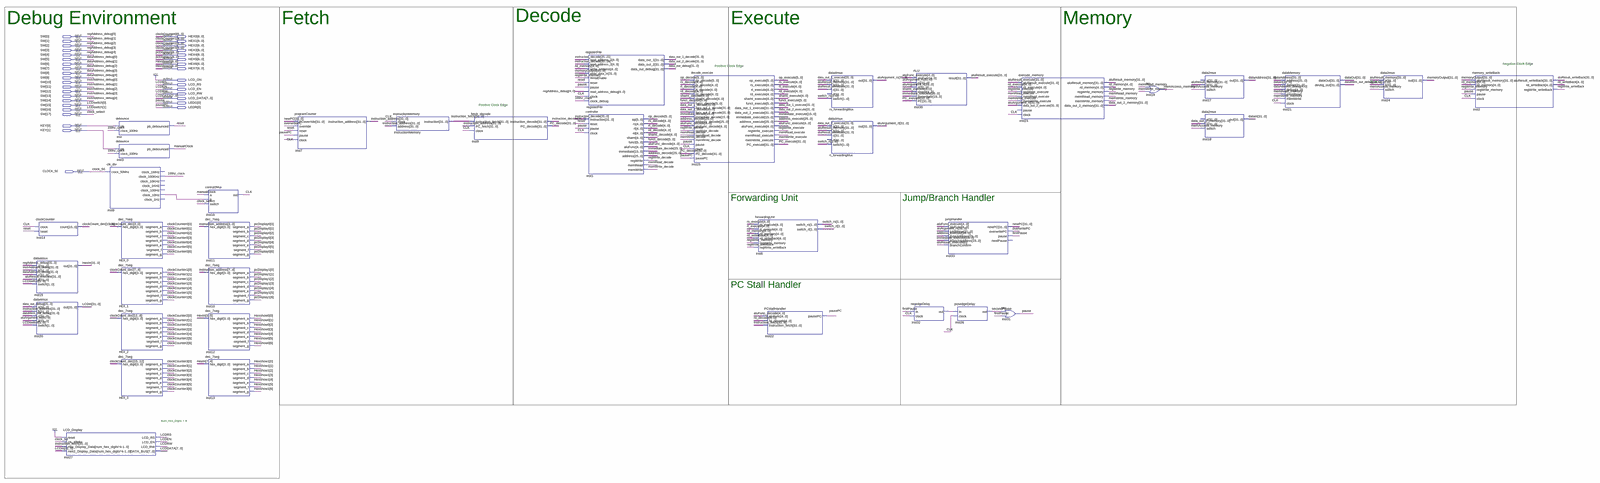
[diagram p0: schematic sheet, whole]
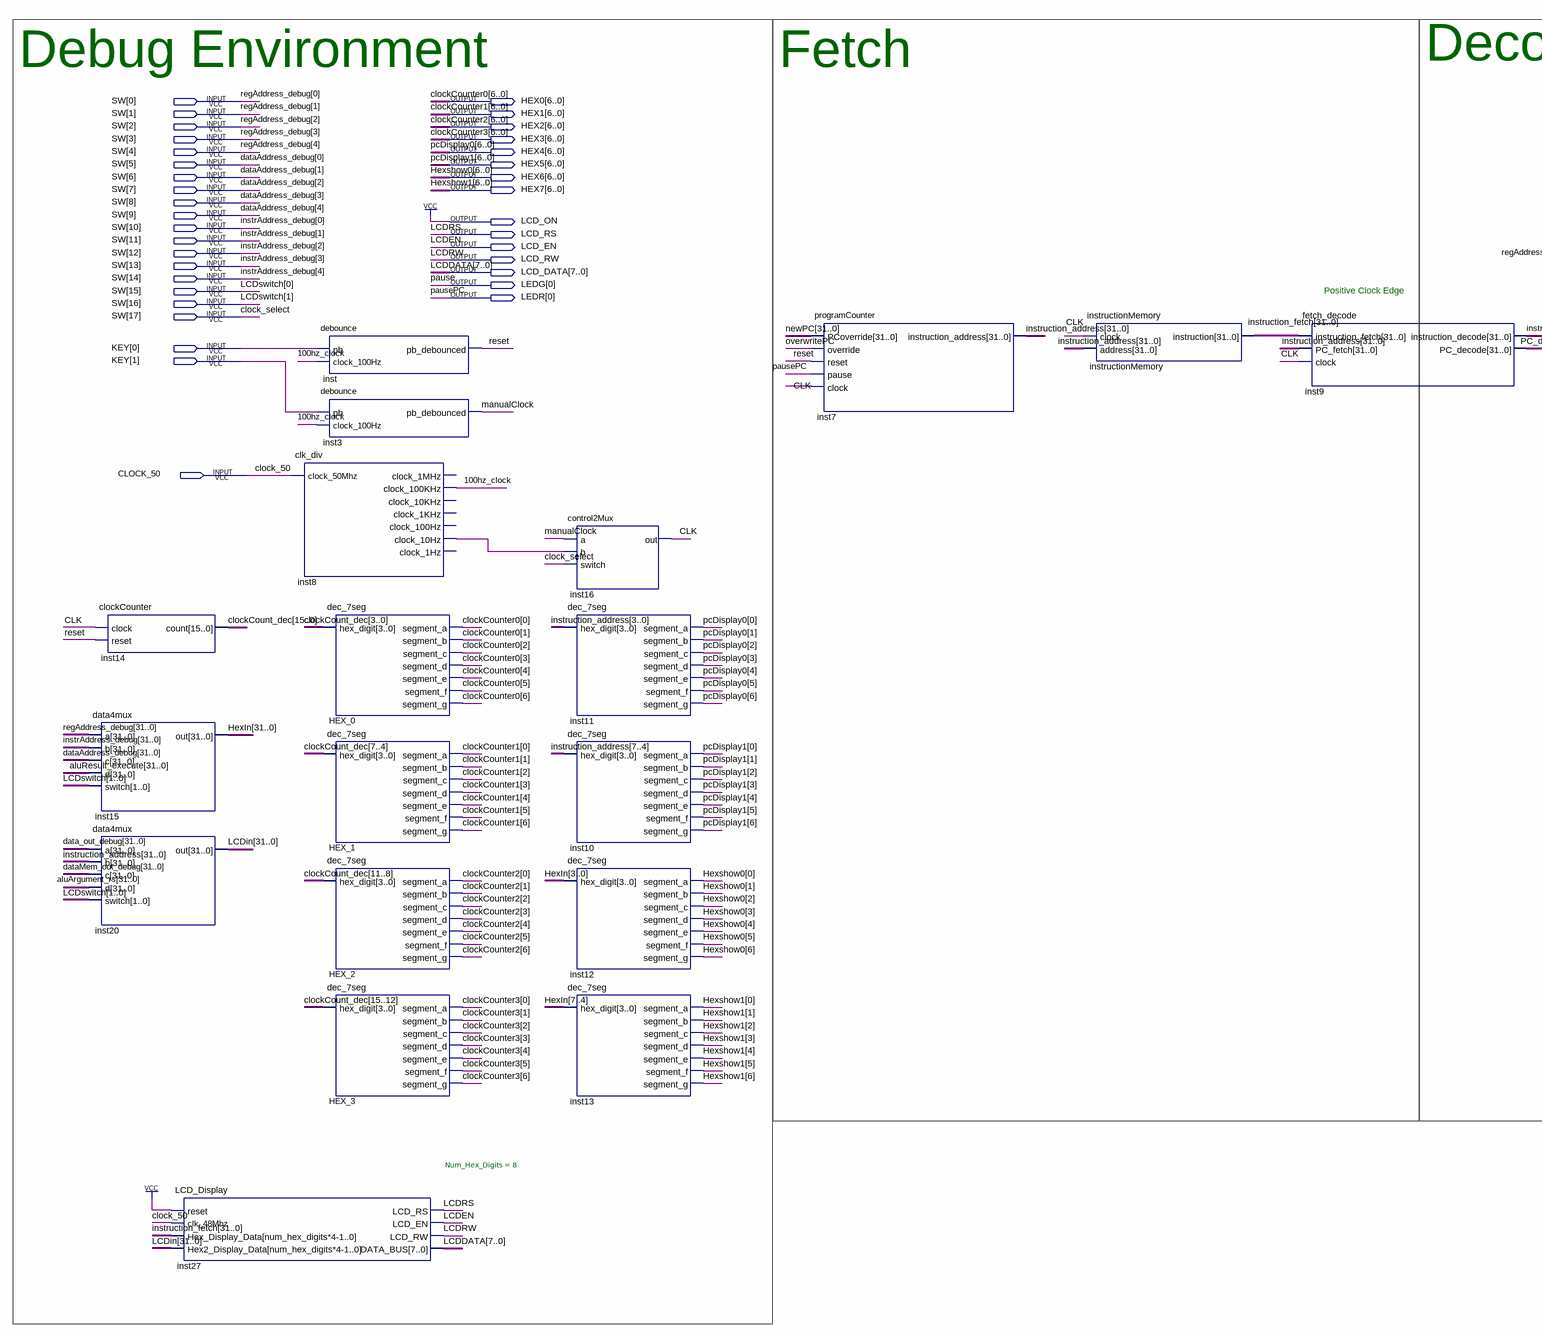
[diagram p1: schematic sheet, left part]
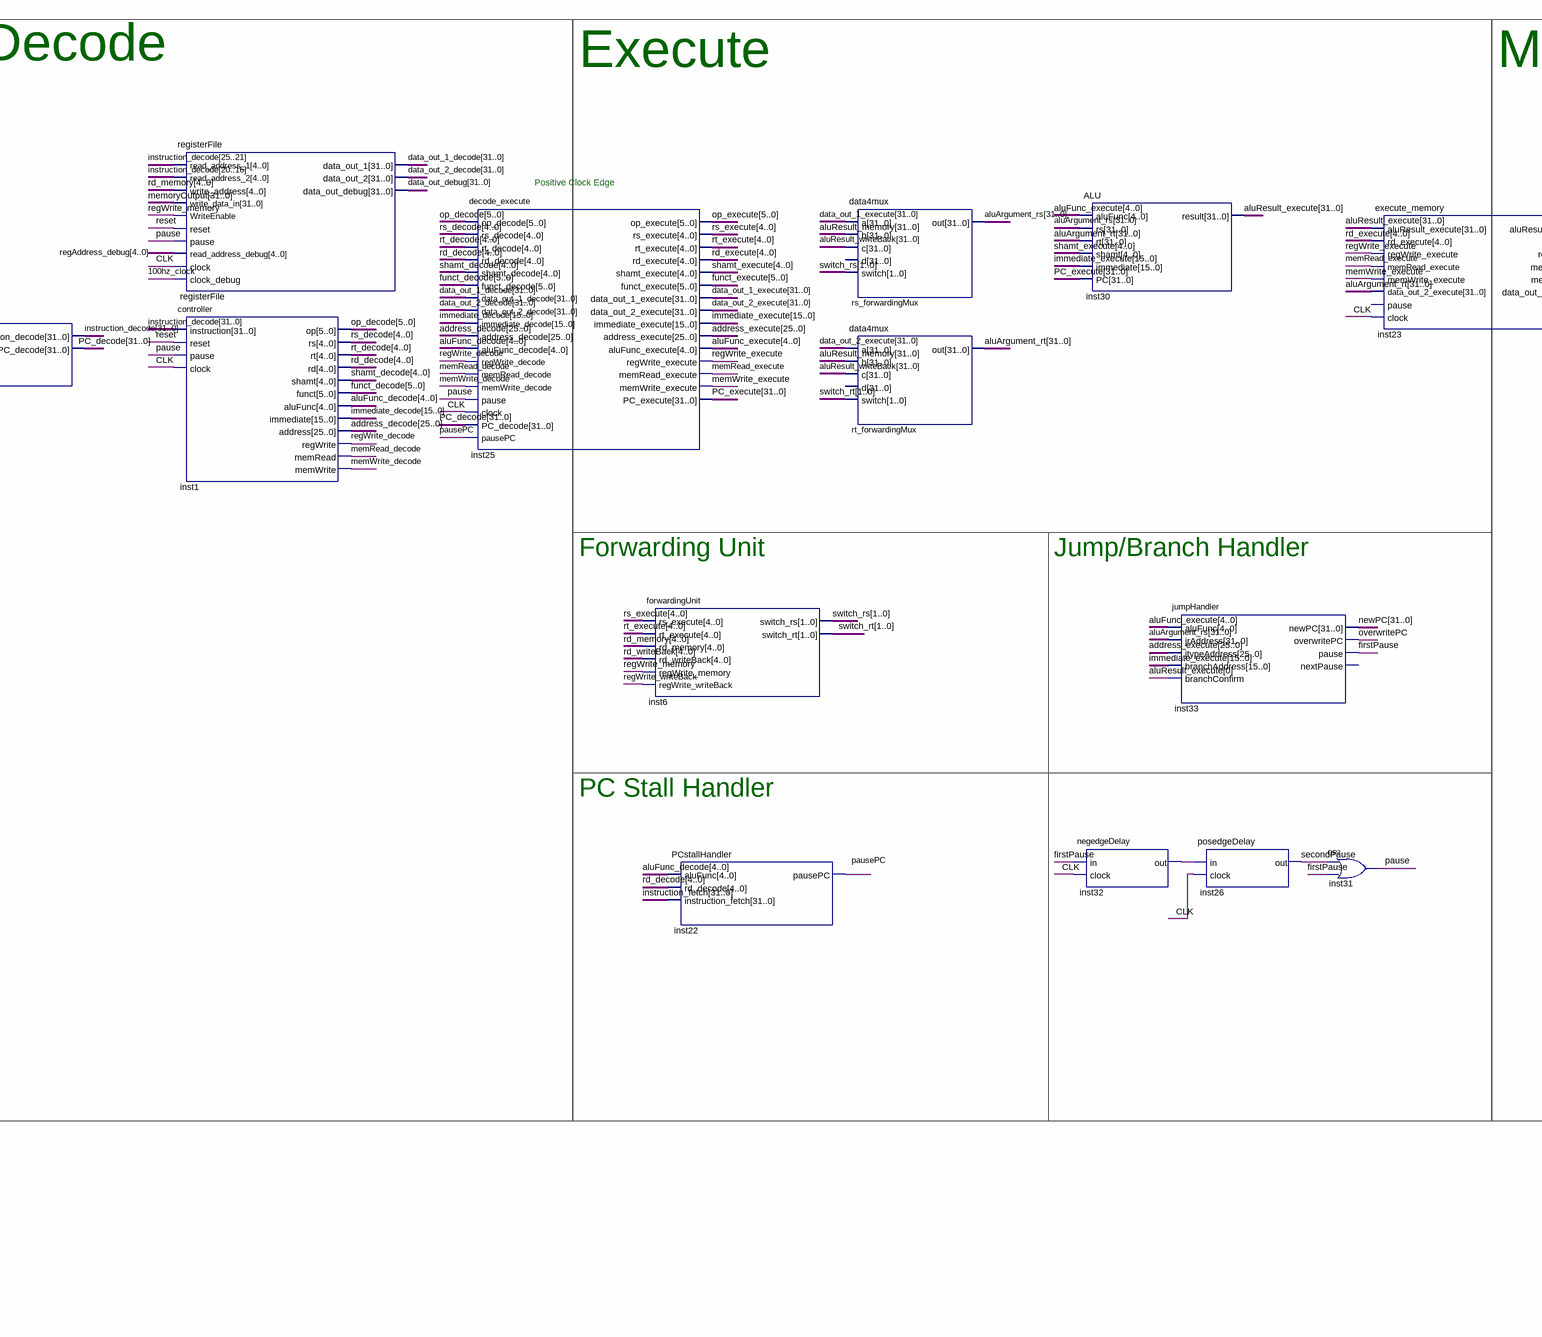
[diagram p2: schematic sheet, centre part]
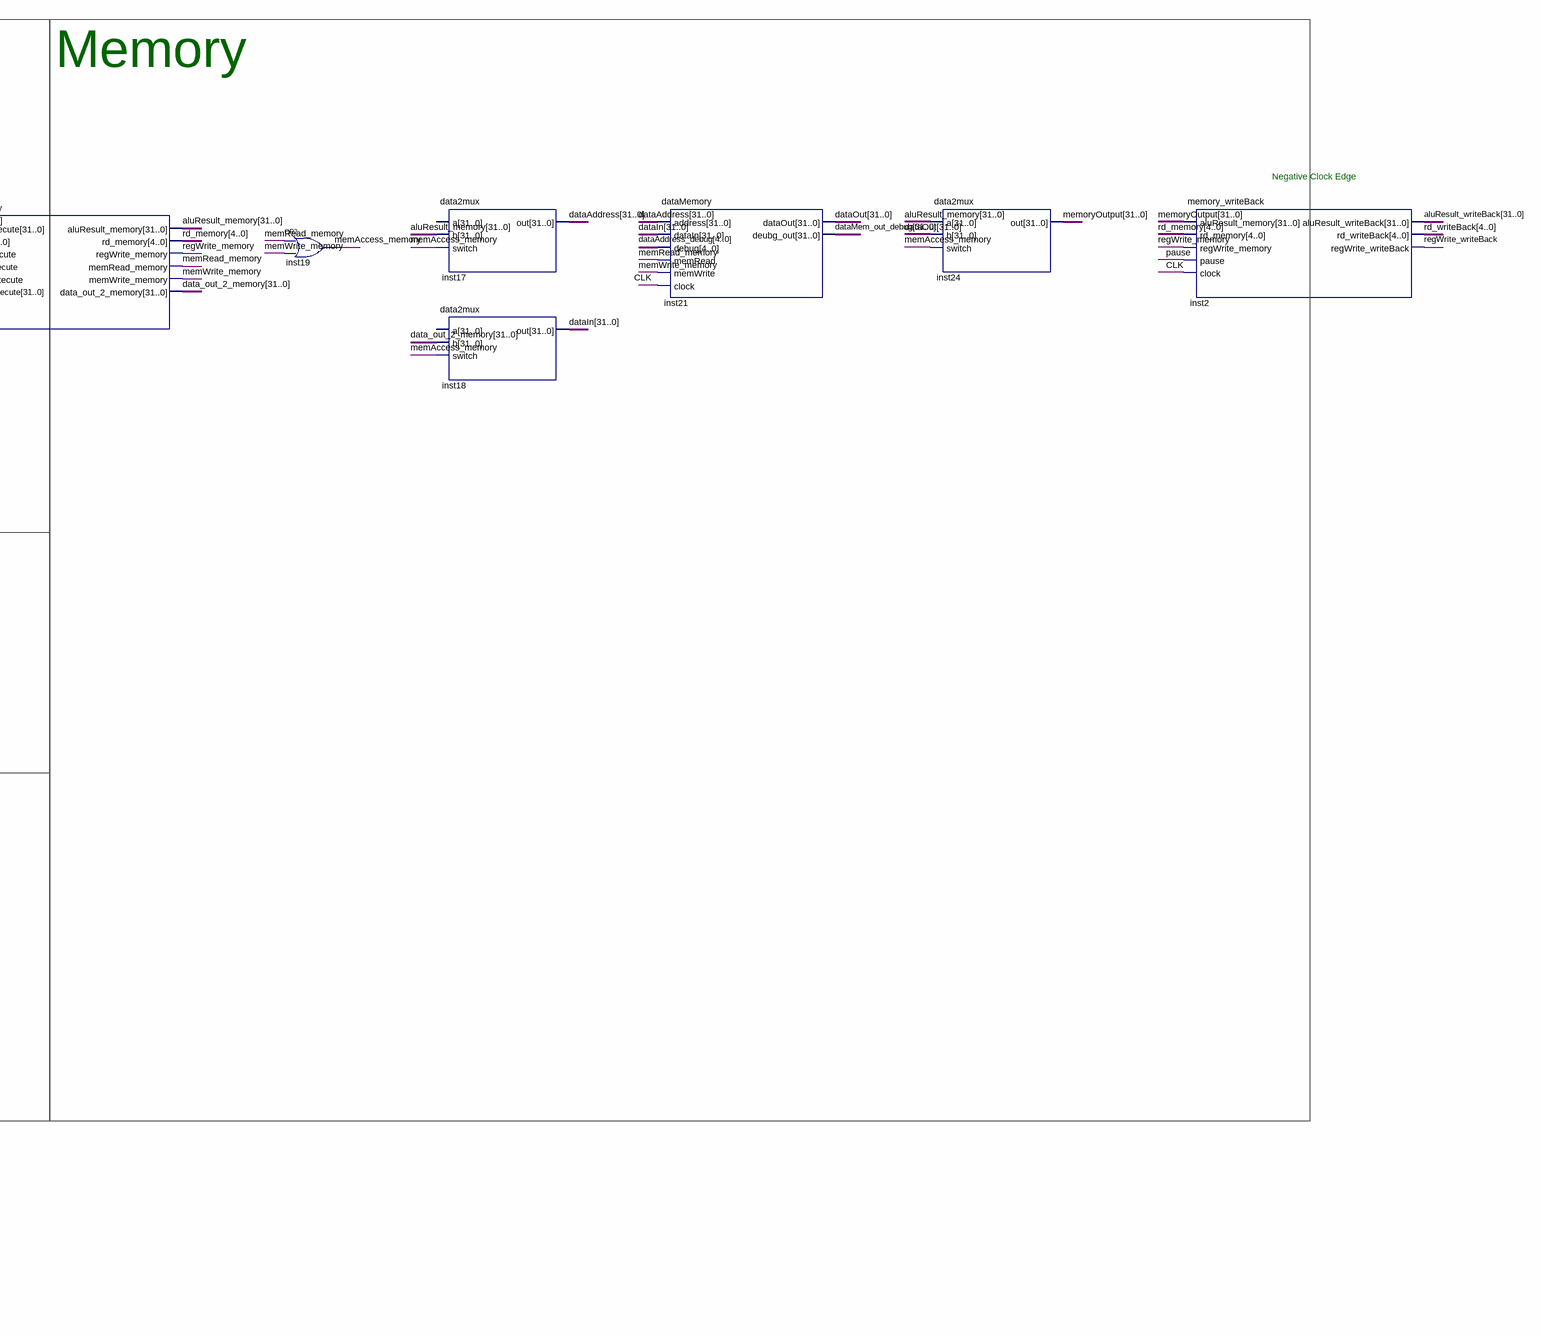
[diagram p3: schematic sheet, right part]
// Quartus schematic BlockDiagram.bdf as structural Verilog: 38 symbols, 36 pins
module BlockDiagram (
  input  [17:0] SW,
  input  [1:0] KEY,
  input  CLOCK_50,
  output [6:0] HEX0,
  output [6:0] HEX1,
  output [6:0] HEX2,
  output [6:0] HEX3,
  output [6:0] HEX4,
  output [6:0] HEX5,
  output [6:0] HEX6,
  output [6:0] HEX7,
  output LCD_ON,
  output LCD_RS,
  output LCD_EN,
  output LCD_RW,
  output [7:0] LCD_DATA,
  output [0:0] LEDG,
  output [0:0] LEDR
);

  wire \100hz_clock , CLK, firstPause, inst8_clock_10hz, inst32_out, manualClock, memAccess_memory,
       memRead_decode, memRead_execute, memRead_memory, memWrite_decode, memWrite_execute, memWrite_memory,
       overwritePC, regWrite_decode, regWrite_execute, regWrite_memory, regWrite_writeBack, reset,
       secondPause;
  wire [1:0] switch_rs, switch_rt;
  wire [4:0] aluFunc_decode, aluFunc_execute, rd_decode, rd_execute, rd_memory, rd_writeBack, rs_decode,
       rs_execute, rt_decode, rt_execute, shamt_decode, shamt_execute;
  wire [5:0] funct_decode, funct_execute, op_decode, op_execute;
  wire [15:0] clockCount_dec, immediate_decode, immediate_execute;
  wire [25:0] address_decode, address_execute;
  wire [31:0] aluArgument_rs, aluArgument_rt, aluResult_execute, aluResult_memory, aluResult_writeBack,
       data_out_1_decode, data_out_1_execute, data_out_2_decode, data_out_2_execute, data_out_2_memory,
       data_out_debug, dataAddress, dataIn, dataMem_out_debug, dataOut, HexIn, instruction_address,
       instruction_decode, instruction_fetch, LCDin, memoryOutput, newPC, PC_decode, PC_execute;
  wire [31:5] dataAddress_debug, instrAddress_debug, regAddress_debug;

  clockCounter inst14 (.clock(CLK), .reset(reset), .count(clockCount_dec));
  data4mux inst15 (
    .a({regAddress_debug, SW[4:0]}), .b({instrAddress_debug, SW[14:10]}), .c({dataAddress_debug, SW[9:5]}),
    .d(aluResult_execute), .switch(SW[16:15]), .out(HexIn));
  data4mux inst20 (
    .a(data_out_debug), .b(instruction_address), .c(dataMem_out_debug), .d(aluArgument_rs),
    .switch(SW[16:15]), .out(LCDin));
  LCD_Display #(.Num_Hex_Digits(8)) inst27 (
    .reset(1'b1), .clk_48Mhz(CLOCK_50), .Hex_Display_Data(instruction_fetch), .Hex2_Display_Data(LCDin),
    .LCD_RS(LCD_RS), .LCD_EN(LCD_EN), .LCD_RW(LCD_RW), .DATA_BUS(LCD_DATA));
  debounce inst (.pb(KEY[0]), .clock_100Hz(\100hz_clock ), .pb_debounced(reset));
  debounce inst3 (.pb(KEY[1]), .clock_100Hz(\100hz_clock ), .pb_debounced(manualClock));
  clk_div inst8 (
    .clock_50Mhz(CLOCK_50), .clock_100KHz(\100hz_clock ), .clock_10Hz(inst8_clock_10hz));  // open: clock_1MHz, clock_10KHz, clock_1KHz, clock_100Hz, clock_1Hz
  dec_7seg HEX_0 (
    .hex_digit(clockCount_dec[3:0]), .segment_a(HEX0[0]), .segment_b(HEX0[1]), .segment_c(HEX0[2]),
    .segment_d(HEX0[3]), .segment_e(HEX0[4]), .segment_f(HEX0[5]), .segment_g(HEX0[6]));
  dec_7seg HEX_1 (
    .hex_digit(clockCount_dec[7:4]), .segment_a(HEX1[0]), .segment_b(HEX1[1]), .segment_c(HEX1[2]),
    .segment_d(HEX1[3]), .segment_e(HEX1[4]), .segment_f(HEX1[5]), .segment_g(HEX1[6]));
  dec_7seg HEX_2 (
    .hex_digit(clockCount_dec[11:8]), .segment_a(HEX2[0]), .segment_b(HEX2[1]), .segment_c(HEX2[2]),
    .segment_d(HEX2[3]), .segment_e(HEX2[4]), .segment_f(HEX2[5]), .segment_g(HEX2[6]));
  dec_7seg HEX_3 (
    .hex_digit(clockCount_dec[15:12]), .segment_a(HEX3[0]), .segment_b(HEX3[1]), .segment_c(HEX3[2]),
    .segment_d(HEX3[3]), .segment_e(HEX3[4]), .segment_f(HEX3[5]), .segment_g(HEX3[6]));
  control2Mux inst16 (.a(manualClock), .b(inst8_clock_10hz), .switch(SW[17]), .out(CLK));
  dec_7seg inst11 (
    .hex_digit(instruction_address[3:0]), .segment_a(HEX4[0]), .segment_b(HEX4[1]), .segment_c(HEX4[2]),
    .segment_d(HEX4[3]), .segment_e(HEX4[4]), .segment_f(HEX4[5]), .segment_g(HEX4[6]));
  dec_7seg inst10 (
    .hex_digit(instruction_address[7:4]), .segment_a(HEX5[0]), .segment_b(HEX5[1]), .segment_c(HEX5[2]),
    .segment_d(HEX5[3]), .segment_e(HEX5[4]), .segment_f(HEX5[5]), .segment_g(HEX5[6]));
  dec_7seg inst12 (
    .hex_digit(HexIn[3:0]), .segment_a(HEX6[0]), .segment_b(HEX6[1]), .segment_c(HEX6[2]),
    .segment_d(HEX6[3]), .segment_e(HEX6[4]), .segment_f(HEX6[5]), .segment_g(HEX6[6]));
  dec_7seg inst13 (
    .hex_digit(HexIn[7:4]), .segment_a(HEX7[0]), .segment_b(HEX7[1]), .segment_c(HEX7[2]),
    .segment_d(HEX7[3]), .segment_e(HEX7[4]), .segment_f(HEX7[5]), .segment_g(HEX7[6]));
  programCounter inst7 (
    .PCoverride(newPC), .override(overwritePC), .reset(reset), .pause(LEDR[0]), .clock(CLK),
    .instruction_address(instruction_address));
  instructionMemory instructionMemory (.clock(CLK), .address(instruction_address), .instruction(instruction_fetch));
  fetch_decode inst9 (
    .instruction_fetch(instruction_fetch), .PC_fetch(instruction_address), .clock(CLK),
    .instruction_decode(instruction_decode), .PC_decode(PC_decode));
  registerFile registerFile (
    .read_address_1(instruction_decode[25:21]), .read_address_2(instruction_decode[20:16]),
    .write_address(rd_memory), .write_data_in(memoryOutput), .WriteEnable(regWrite_memory), .reset(reset),
    .pause(LEDG[0]), .read_address_debug(SW[4:0]), .clock(CLK), .clock_debug(\100hz_clock ),
    .data_out_1(data_out_1_decode), .data_out_2(data_out_2_decode), .data_out_debug(data_out_debug));
  controller inst1 (
    .instruction(instruction_decode), .reset(reset), .pause(LEDG[0]), .clock(CLK), .op(op_decode),
    .rs(rs_decode), .rt(rt_decode), .rd(rd_decode), .shamt(shamt_decode), .funct(funct_decode),
    .aluFunc(aluFunc_decode), .immediate(immediate_decode), .address(address_decode),
    .regWrite(regWrite_decode), .memRead(memRead_decode), .memWrite(memWrite_decode));
  decode_execute inst25 (
    .op_decode(op_decode), .rs_decode(rs_decode), .rt_decode(rt_decode), .rd_decode(rd_decode),
    .shamt_decode(shamt_decode), .funct_decode(funct_decode), .data_out_1_decode(data_out_1_decode),
    .data_out_2_decode(data_out_2_decode), .immediate_decode(immediate_decode),
    .address_decode(address_decode), .aluFunc_decode(aluFunc_decode), .regWrite_decode(regWrite_decode),
    .memRead_decode(memRead_decode), .memWrite_decode(memWrite_decode), .pause(LEDG[0]), .clock(CLK),
    .PC_decode(PC_decode), .pausePC(LEDR[0]), .op_execute(op_execute), .rs_execute(rs_execute),
    .rt_execute(rt_execute), .rd_execute(rd_execute), .shamt_execute(shamt_execute),
    .funct_execute(funct_execute), .data_out_1_execute(data_out_1_execute),
    .data_out_2_execute(data_out_2_execute), .immediate_execute(immediate_execute),
    .address_execute(address_execute), .aluFunc_execute(aluFunc_execute),
    .regWrite_execute(regWrite_execute), .memRead_execute(memRead_execute),
    .memWrite_execute(memWrite_execute), .PC_execute(PC_execute));
  forwardingUnit inst6 (
    .rs_execute(rs_execute), .rt_execute(rt_execute), .rd_memory(rd_memory), .rd_writeBack(rd_writeBack),
    .regWrite_memory(regWrite_memory), .regWrite_writeBack(regWrite_writeBack), .switch_rs(switch_rs),
    .switch_rt(switch_rt));
  PCstallHandler inst22 (
    .aluFunc(aluFunc_decode), .rd_decode(rd_decode), .instruction_fetch(instruction_fetch), .pausePC(LEDR[0]));
  data4mux rs_forwardingMux (
    .a(data_out_1_execute), .b(aluResult_memory), .c(aluResult_writeBack), .switch(switch_rs),
    .out(aluArgument_rs));  // open: d
  data4mux rt_forwardingMux (
    .a(data_out_2_execute), .b(aluResult_memory), .c(aluResult_writeBack), .switch(switch_rt),
    .out(aluArgument_rt));  // open: d
  negedgeDelay inst32 (.in(firstPause), .clock(CLK), .out(inst32_out));
  ALU inst30 (
    .aluFunc(aluFunc_execute), .rs(aluArgument_rs), .rt(aluArgument_rt), .shamt(shamt_execute),
    .immediate(immediate_execute), .PC(PC_execute), .result(aluResult_execute));
  jumpHandler inst33 (
    .aluFunc(aluFunc_execute), .jrAddress(aluArgument_rs), .jtypeAddress(address_execute),
    .branchAddress(immediate_execute), .branchConfirm(aluResult_execute[0]), .newPC(newPC),
    .overwritePC(overwritePC), .pause(firstPause));  // open: nextPause
  posedgeDelay inst26 (.in(inst32_out), .clock(CLK), .out(secondPause));
  or inst31 (LEDG[0], secondPause, firstPause);
  execute_memory inst23 (
    .aluResult_execute(aluResult_execute), .rd_execute(rd_execute), .regWrite_execute(regWrite_execute),
    .memRead_execute(memRead_execute), .memWrite_execute(memWrite_execute),
    .data_out_2_execute(aluArgument_rt), .clock(CLK), .aluResult_memory(aluResult_memory),
    .rd_memory(rd_memory), .regWrite_memory(regWrite_memory), .memRead_memory(memRead_memory),
    .memWrite_memory(memWrite_memory), .data_out_2_memory(data_out_2_memory));  // open: pause
  or inst19 (memAccess_memory, memRead_memory, memWrite_memory);
  data2mux inst17 (.b(aluResult_memory), .switch(memAccess_memory), .out(dataAddress));  // open: a
  data2mux inst18 (.b(data_out_2_memory), .switch(memAccess_memory), .out(dataIn));  // open: a
  dataMemory inst21 (
    .address(dataAddress), .dataIn(dataIn), .debug(SW[9:5]), .memRead(memRead_memory),
    .memWrite(memWrite_memory), .clock(CLK), .dataOut(dataOut), .deubg_out(dataMem_out_debug));
  data2mux inst24 (.a(aluResult_memory), .b(dataOut), .switch(memAccess_memory), .out(memoryOutput));
  memory_writeBack inst2 (
    .aluResult_memory(memoryOutput), .rd_memory(rd_memory), .regWrite_memory(regWrite_memory),
    .pause(LEDG[0]), .clock(CLK), .aluResult_writeBack(aluResult_writeBack), .rd_writeBack(rd_writeBack),
    .regWrite_writeBack(regWrite_writeBack));

  assign LCD_ON = 1'b1;

  // Other names for the same wires on the sheet: clock_select = SW[17]; clockCounter0[6:0] = HEX0;
  //   clockCounter1[6:0] = HEX1; clockCounter2[6:0] = HEX2; clockCounter3[6:0] = HEX3;
  //   dataAddress_debug[4:0] = SW[9:5]; Hexshow0[6:0] = HEX6; Hexshow1[6:0] = HEX7;
  //   instrAddress_debug[4:0] = SW[14:10]; LCDDATA[7:0] = LCD_DATA; LCDEN = LCD_EN; LCDRS = LCD_RS; LCDRW = LCD_RW;
  //   LCDswitch[1:0] = SW[16:15]; pause = LEDG[0]; pausePC = LEDR[0]; pcDisplay0[6:0] = HEX4; pcDisplay1[6:0] = HEX5;
  //   regAddress_debug[4:0] = SW[4:0]

  // Notes on the sheet:
  //   Decode
  //   Debug Environment
  //   Fetch
  //   Execute
  //   Memory
  //   Negative Clock Edge
  //   Positive Clock Edge
  //   Positive Clock Edge
  //   Forwarding Unit
  //   Jump/Branch Handler
  //   PC Stall Handler
endmodule
